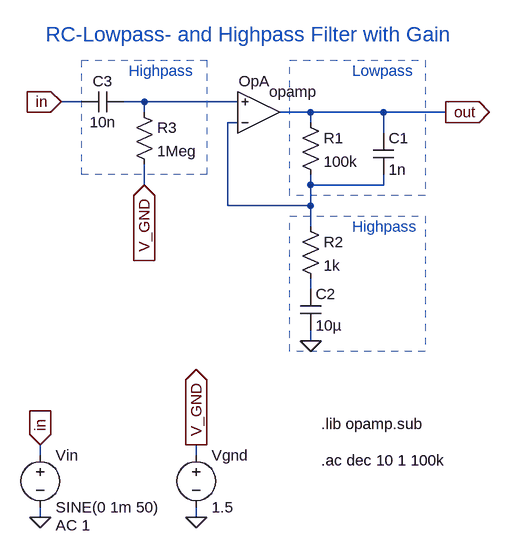
[diagram p0: schematic RC_lowpass_highpass.asc]
RC_lowpass_highpass.asc, the LTspice schematic file:
Version 4
SHEET 1 880 680
WIRE -32 -96 -64 -96
WIRE 64 -96 32 -96
WIRE 208 -96 64 -96
WIRE 64 -80 64 -96
WIRE 320 -80 272 -80
WIRE 432 -80 320 -80
WIRE 528 -80 432 -80
WIRE 208 -64 192 -64
WIRE 320 -64 320 -80
WIRE 432 -48 432 -80
WIRE 64 32 64 0
WIRE 320 32 320 16
WIRE 432 32 432 16
WIRE 432 32 320 32
WIRE 192 64 192 -64
WIRE 320 64 320 32
WIRE 320 64 192 64
WIRE 320 96 320 64
WIRE 320 192 320 176
WIRE 320 272 320 256
WIRE -96 448 -96 432
WIRE 144 448 144 432
WIRE -96 544 -96 528
WIRE 144 544 144 528
FLAG -96 544 0
FLAG -96 432 in
IOPIN -96 432 In
FLAG 320 272 0
FLAG 64 32 V_GND
IOPIN 64 32 In
FLAG -64 -96 in
IOPIN -64 -96 In
FLAG 528 -80 out
IOPIN 528 -80 Out
FLAG 144 544 0
FLAG 144 432 V_GND
IOPIN 144 432 Out
SYMBOL OpAmps\\opamp 240 -16 M180
WINDOW 0 -31 112 Left 2
SYMATTR InstName OpA
SYMBOL voltage -96 432 R0
WINDOW 123 24 124 Left 2
WINDOW 39 0 0 Left 0
SYMATTR Value2 AC 1
SYMATTR InstName Vin
SYMATTR Value SINE(0 1m 50)
SYMBOL res 304 -80 R0
SYMATTR InstName R1
SYMATTR Value 100k
SYMBOL res 304 80 R0
SYMATTR InstName R2
SYMATTR Value 1k
SYMBOL res 48 -96 R0
SYMATTR InstName R3
SYMATTR Value 1Meg
SYMBOL cap 416 -48 R0
SYMATTR InstName C1
SYMATTR Value 1n
SYMBOL cap 304 192 R0
SYMATTR InstName C2
SYMATTR Value 10µ
SYMBOL cap 32 -112 R90
WINDOW 0 0 32 VBottom 2
WINDOW 3 32 32 VTop 2
SYMATTR InstName C3
SYMATTR Value 10n
SYMBOL voltage 144 432 R0
WINDOW 123 24 124 Left 2
WINDOW 39 0 0 Left 0
SYMATTR InstName Vgnd
SYMATTR Value 1.5
TEXT 336 400 Left 2 !.lib opamp.sub
TEXT 336 456 Left 2 !.ac dec 10 1 100k
TEXT -88 -200 Left 3 ;RC-Lowpass- and Highpass Filter with Gain
TEXT 40 -144 Left 2 ;Highpass
TEXT 384 96 Left 2 ;Highpass
TEXT 384 -144 Left 2 ;Lowpass
RECTANGLE Normal 160 16 -32 -160 2
RECTANGLE Normal 496 48 288 -160 2
RECTANGLE Normal 496 288 288 80 2

The netlist it stands for:
* RC_lowpass_highpass.asc
XOpA N002 N001 out opamp Aol=100K GBW=10Meg  ; pins invin noninvin out
Vin in 0 SINE(0 1m 50) AC 1
R1 out N002 100k
R2 N002 N003 1k
R3 N001 V_GND 1Meg
C1 out N002 1n
C2 N003 0 10µ
C3 N001 in 10n
Vgnd V_GND 0 1.5
.lib opamp.sub
.ac dec 10 1 100k
* RC-Lowpass- and Highpass Filter with Gain
* Highpass
* Highpass
* Lowpass
.backanno
.end